# EAGLE schematic Motor_Board-Rev6 (EAGLE 6.6.0)
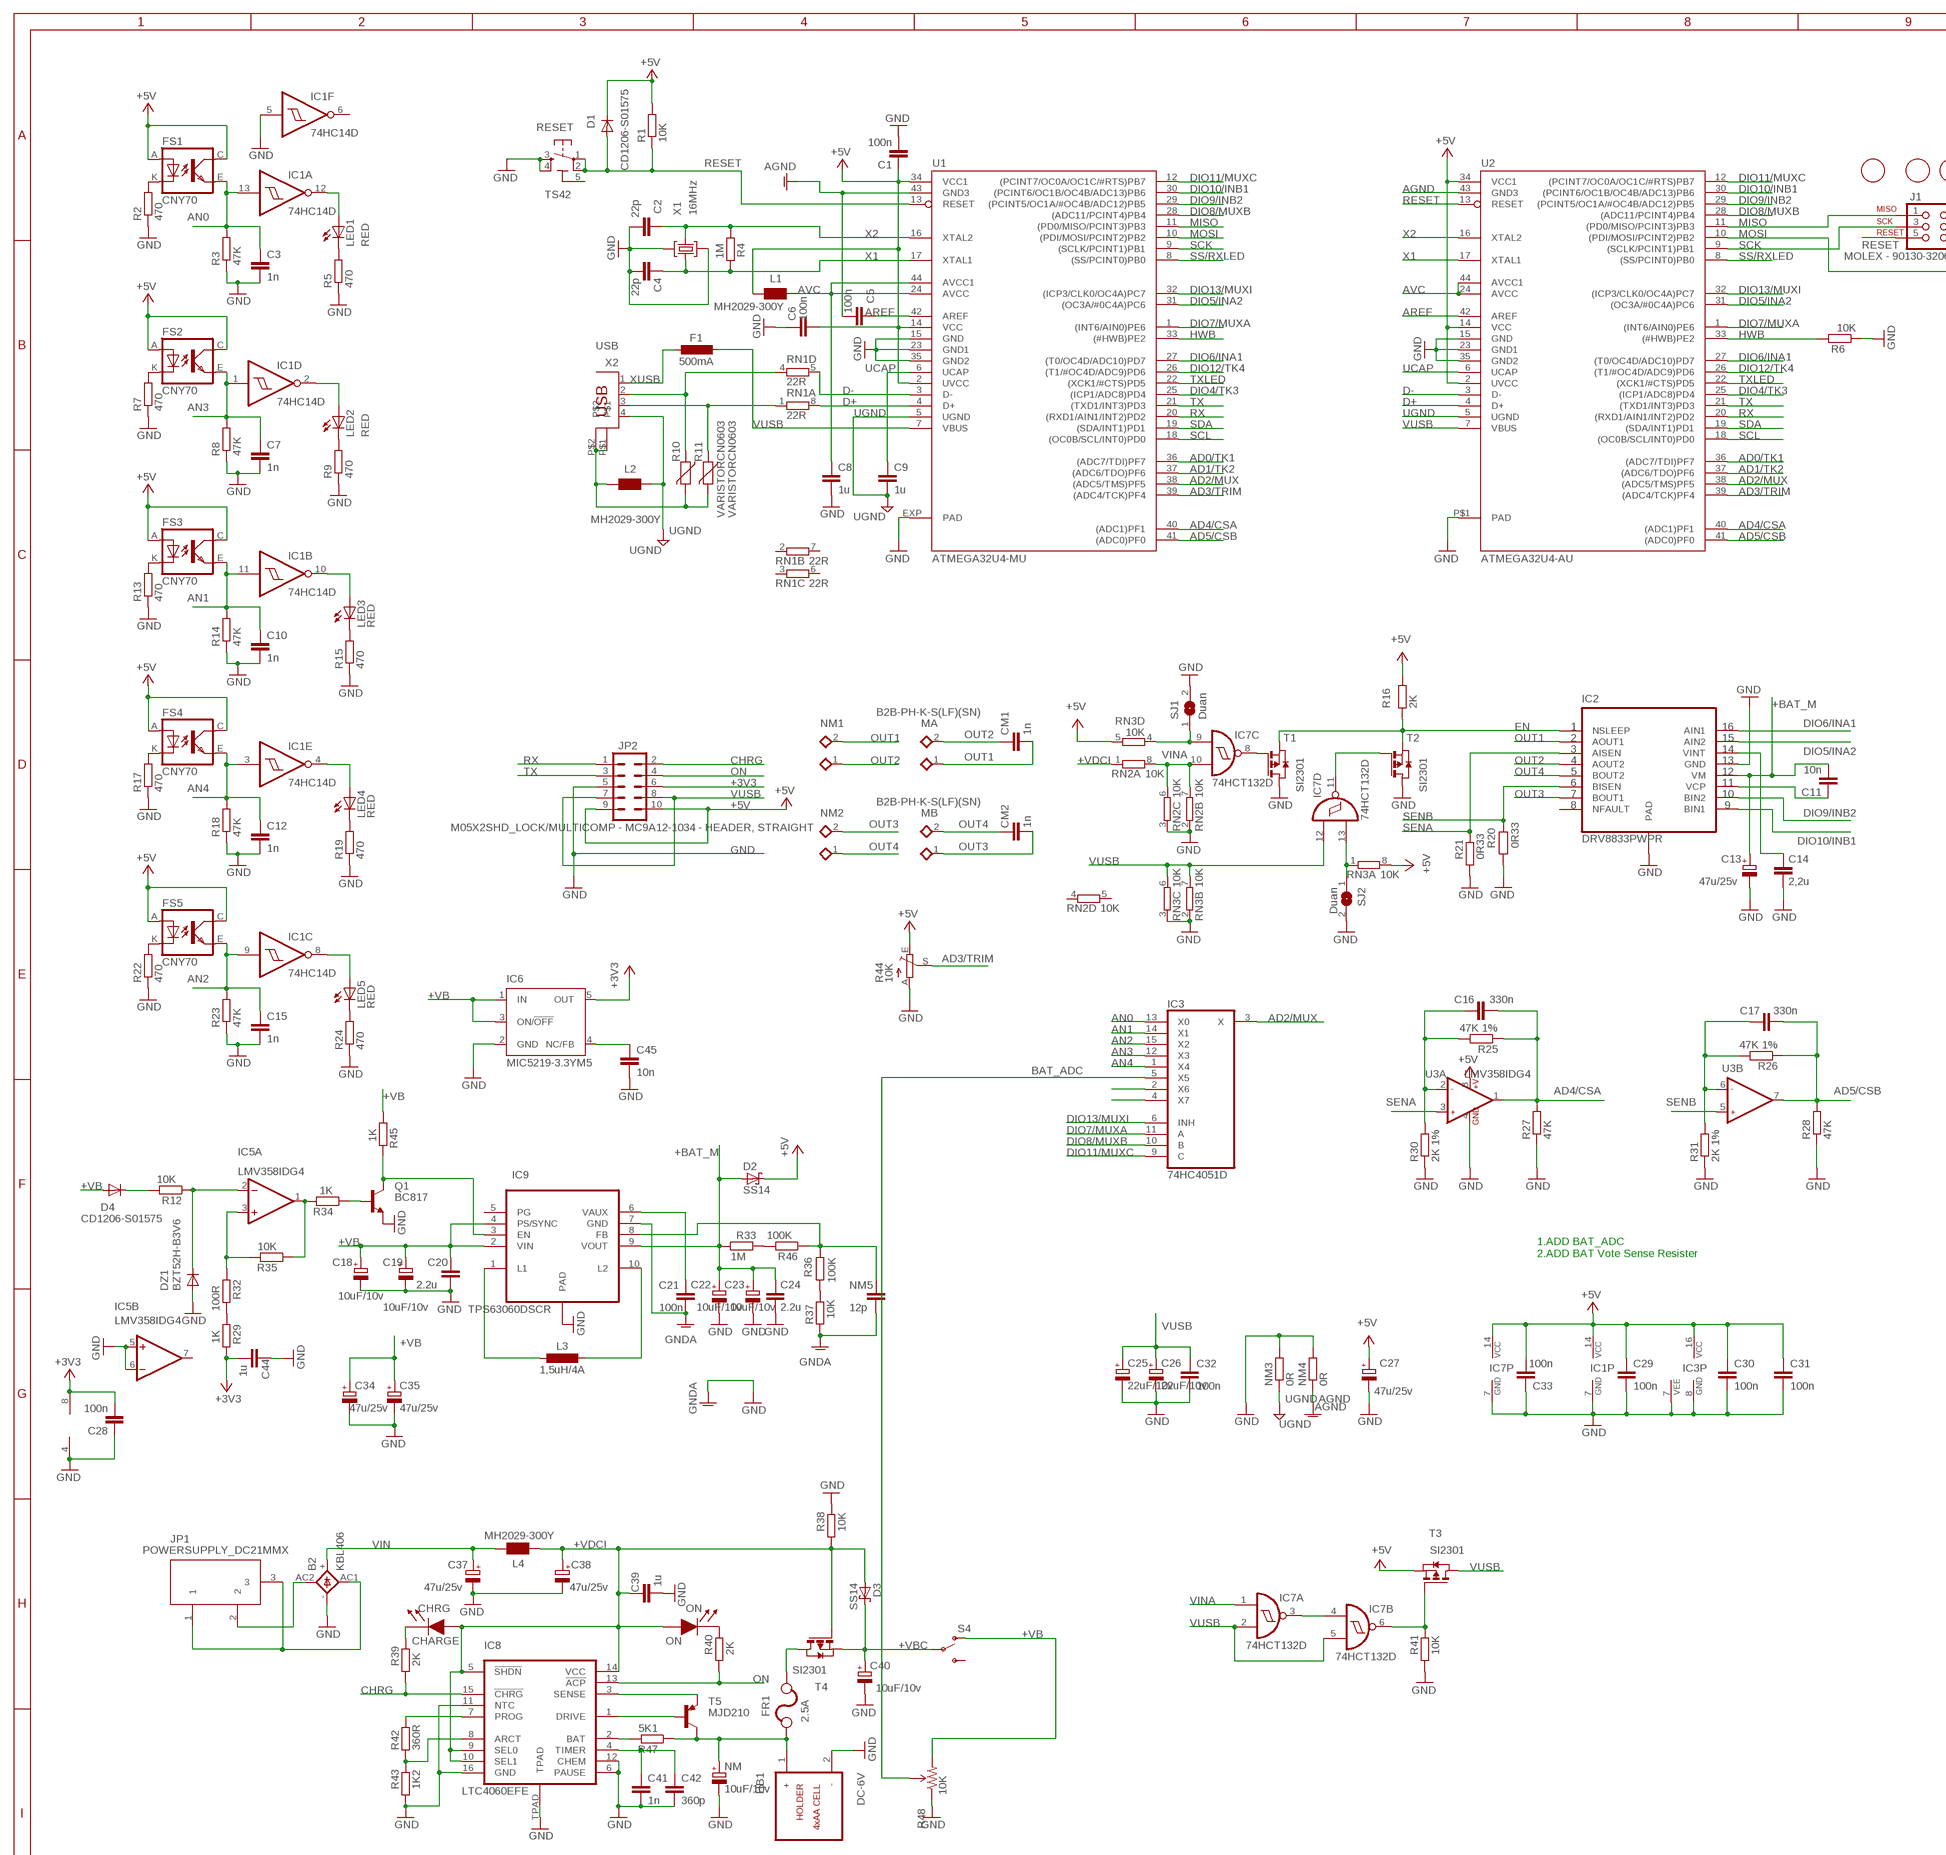
[diagram p0: schematic, sheet 1, part 1 of 2]
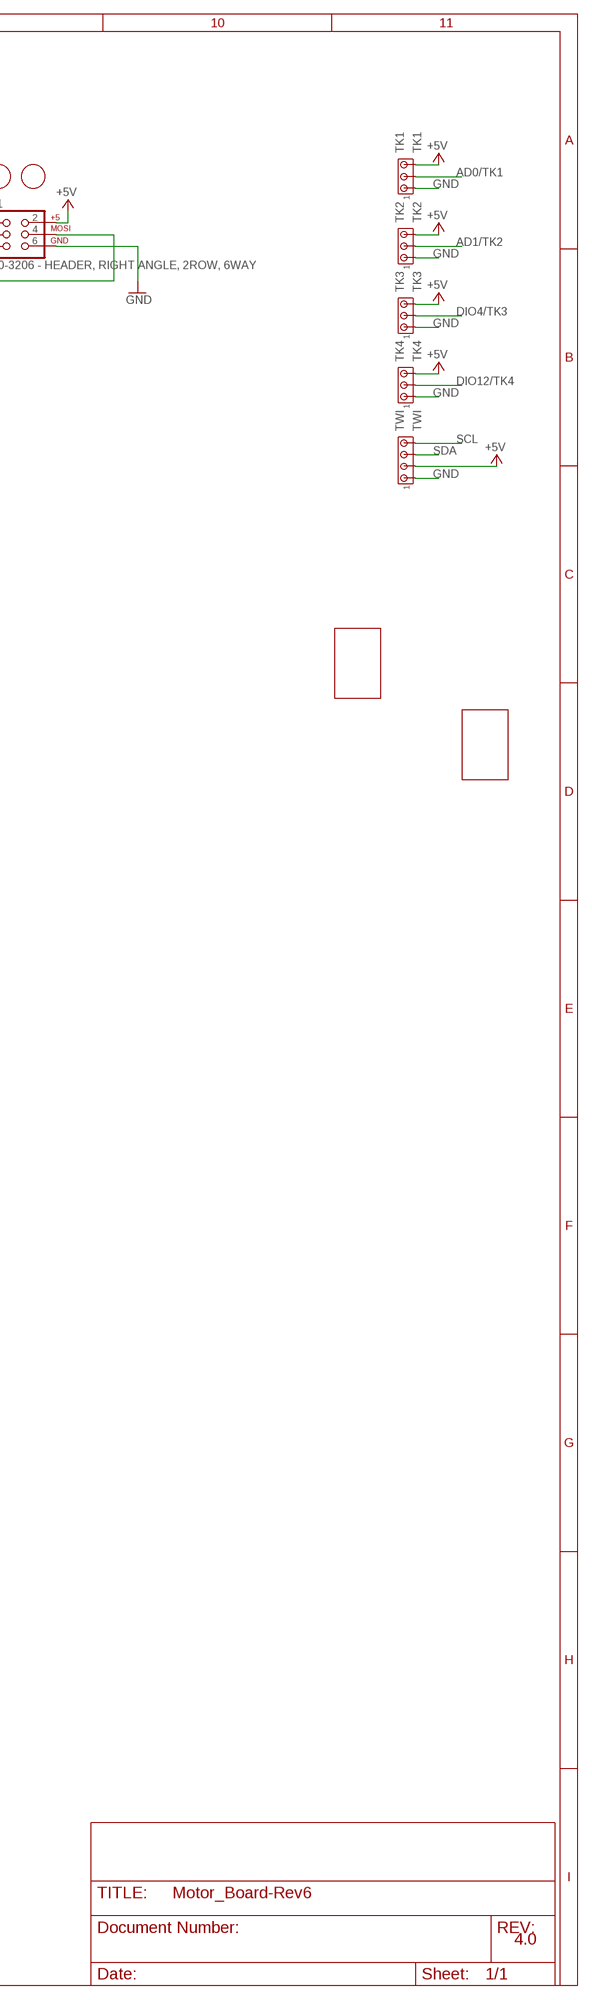
[diagram p1: schematic, sheet 1, part 2 of 2]

## Parts
B2  KBL406  KBL  [KBL]
C1  100n  C-EUC0603  [C0603-ROUND]
C2  22p  C-EUC0603  [C0603-ROUND]
C3  1n  C-EUC0603  [C0603-ROUND]
C4  22p  C-EUC0603  [C0603-ROUND]
C5  100n  C-EUC0603  [C0603-ROUND]
C6  100n  C-EUC0603  [C0603-ROUND]
C7  1n  C-EUC0603  [C0603-ROUND]
C8  1u  C-EUC0603  [C0603-ROUND]
C9  1u  C-EUC0603  [C0603-ROUND]
C10  1n  C-EUC0603  [C0603-ROUND]
C11  10n  C-EUC0603  [C0603-ROUND]
C12  1n  C-EUC0603  [C0603-ROUND]
C13  47u/25v  CPOL-EUD  [PANASONIC_D]
C14  2,2u  C-EUC0805K  [C0805K]
C15  1n  C-EUC0603  [C0603-ROUND]
C16  330n  C-EUC0603  [C0603-ROUND]
C17  330n  C-EUC0603  [C0603-ROUND]
C18  10uF/10v  CPOL-EUSMCB  [SMC_B]
C19  10uF/10v  CPOL-EUSMCB  [SMC_B]
C20  2.2u  C-EUC0805K  [C0805K]
C21  100n  C-EUC0603  [C0603-ROUND]
C22  10uF/10v  CPOL-EUSMCB  [SMC_B]
C23  10uF/10v  CPOL-EUSMCB  [SMC_B]
C24  2.2u  C-EUC0805K  [C0805K]
C25  22uF/10v  CPOL-EUSMCB  [SMC_B]
C26  22uF/10v  CPOL-EUSMCB  [SMC_B]
C27  47u/25v  CPOL-EUD  [PANASONIC_D]
C28  100n  C-EUC0603  [C0603-ROUND]
C29  100n  C-EUC0603  [C0603-ROUND]
C30  100n  C-EUC0603  [C0603-ROUND]
C31  100n  C-EUC0603  [C0603-ROUND]
C32  100n  C-EUC0603  [C0603-ROUND]
C33  100n  C-EUC0603  [C0603-ROUND]
C34  47u/25v  CPOL-EUD  [PANASONIC_D]
C35  47u/25v  CPOL-EUD  [PANASONIC_D]
C37  47u/25v  CPOL-EUD  [PANASONIC_D]
C38  47u/25v  CPOL-EUD  [PANASONIC_D]
C39  1u  C-EUC0603  [C0603-ROUND]
C40  10uF/10v  CPOL-EUSMCB  [SMC_B]
C41  1n  C-EUC0603  [C0603-ROUND]
C42  360p  C-EUC0603  [C0603-ROUND]
C44  1u  C-EUC0603  [C0603-ROUND]
C45  10n  C-EU0603-RND  [C0603-ROUND]
CHRG  CHARGE  MYSMD_LED0805  [SMD_LED0805]
CM1  1n  C-EUC0603  [C0603-ROUND]
CM2  1n  C-EUC0603  [C0603-ROUND]
D1  CD1206-S01575  DIODE-MINIMELF  [MINIMELF]
D2  SS14  SCHOTTKY-DIODESMD  [SMB]
D3  SS14  SCHOTTKY-DIODESMD  [SMB]
D4  CD1206-S01575  DIODE-MINIMELF  [MINIMELF]
DCML1  COMPLUBOT1_LOTTIE_LEMON_DC_MOTOR_48X_L  [COMPLUBOT1_CARCASA_MOTOR_L_LOTTIE_LEMON]
DZ1  BZT52H-B3V6  DIODE-SOD123  [SOD123]
F1  500mA  L-EUL1812  [L1812]
FM1  FIDUCIALMOUNT  [FIDUCIA-MOUNT]
FM2  FIDUCIALMOUNT  [FIDUCIA-MOUNT]
FM3  FIDUCIALMOUNT  [FIDUCIA-MOUNT]
FR1  2.5A  PTC_RESETTABLE_FUSES  [MF-MSMF-S2]
FS1  CNY70  [4]
FS2  CNY70  [4]
FS3  CNY70  [4]
FS4  CNY70  [4]
FS5  CNY70  [4]
HB1  DC-6V  SMARTPRJ_4XAA-BATTERY_HOLDER  [SMARTPRJ_4XAA_BATTERY-HOLDER]
IC1  74HC14D  [SO14]
IC2  DRV8833PWPR  DRV8833  [R-PDSO-G16]
IC3  74HC4051D  4051D  [SO16]
IC5  LMV358IDG4  LM358D  [SO08]
IC6  MIC5219-3.3YM5  LP2985-XXDBVR33  [SOT23-DBV]
IC7  74HCT132D  [SO14]
IC8  LTC4060EFE  LTC4060  [TSSOP16]
IC9  TPS63060DSCR  TPS63060  [R-PVSON-10N]
J1  MOLEX - 90130-3206 - HEADER, RIGHT ANGLE, 2ROW, 6WAY  AVR_SPI_PRG_6PTH  [2X3]
JP1  POWERSUPPLY_DC21MMX  [POWERSUPPLY_DC-21MM]
JP2  M05X2SHD_LOCK/MULTICOMP - MC9A12-1034 - HEADER, STRAIGHT  M05X2SHD_LOCK  [2X5-SHROUDED_LOCK]
L1  MH2029-300Y  WE-CBF_0805  [0805]
L2  MH2029-300Y  WE-CBF_0805  [0805]
L3  1,5uH/4A  L-EUWE-TPC  [POWER-CHOKE_WE-TPC]
L4  MH2029-300Y  WE-CBF_0805  [0805]
LED1  RED  LEDCHIP-LED0805  [CHIP-LED0805]
LED2  RED  LEDCHIP-LED0805  [CHIP-LED0805]
LED3  RED  LEDCHIP-LED0805  [CHIP-LED0805]
LED4  RED  LEDCHIP-LED0805  [CHIP-LED0805]
LED5  RED  LEDCHIP-LED0805  [CHIP-LED0805]
MA  B2B-PH-K-S(LF)(SN)  B2B-PH-KL  [B2B-PH_KL]
MB  B2B-PH-K-S(LF)(SN)  B2B-PH-KL  [B2B-PH_KL]
NM  10uF/10v  CPOL-EUSMCB  [SMC_B]
NM1  B2B-PH-K-S(LF)(SN)  B2B-PH-KL  [B2B-PH_KL]
NM2  B2B-PH-K-S(LF)(SN)  B2B-PH-KL  [B2B-PH_KL]
NM3  0R  R-EU_R0805  [R0805]
NM4  0R  R-EU_R0805  [R0805]
NM5  12p  C-EUC0603  [C0603-ROUND]
ON  ON  MYSMD_LED0805  [SMD_LED0805]
Q1  BC817  BC847BSMD  [SOT23]
R1  10K  R-EU_0603-RND  [R0603-ROUND]
R2  470  R-EU_R0603  [R0603-ROUND]
R3  47K  R-EU_R0603  [R0603-ROUND]
R4  1M  R-EU_0603-RND  [R0603-ROUND]
R5  470  R-EU_R0603  [R0603-ROUND]
R6  10K  R-EU_0603-RND  [R0603-ROUND]
R7  470  R-EU_R0603  [R0603-ROUND]
R8  47K  R-EU_0603-RND  [R0603-ROUND]
R9  470  R-EU_0603-RND  [R0603-ROUND]
R10  VARISTORCN0603  [CT/CN0603]
R11  VARISTORCN0603  [CT/CN0603]
R12  10K  R-EU_0603-RND  [R0603-ROUND]
R13  470  R-EU_R0603  [R0603-ROUND]
R14  47K  R-EU_R0603  [R0603-ROUND]
R15  470  R-EU_R0603  [R0603-ROUND]
R16  2K  R-EU_0603-RND  [R0603-ROUND]
R17  470  R-EU_R0603  [R0603-ROUND]
R18  47K  R-EU_R0603  [R0603-ROUND]
R19  470  R-EU_R0603  [R0603-ROUND]
R20  0R33  R-EU_R1206  [R1206]
R21  0R33  R-EU_R1206  [R1206]
R22  470  R-EU_R0603  [R0603-ROUND]
R23  47K  R-EU_R0603  [R0603-ROUND]
R24  470  R-EU_R0603  [R0603-ROUND]
R25  47K 1%  R-EU_0603-RND  [R0603-ROUND]
R26  47K 1%  R-EU_0603-RND  [R0603-ROUND]
R27  47K  R-EU_0603-RND  [R0603-ROUND]
R28  47K  R-EU_0603-RND  [R0603-ROUND]
R29  1K  R-EU_0603-RND  [R0603-ROUND]
R30  2K 1%  R-EU_0603-RND  [R0603-ROUND]
R31  2K 1%  R-EU_0603-RND  [R0603-ROUND]
R32  100R  R-EU_0603-RND  [R0603-ROUND]
R33  1M  R-EU_0603-RND  [R0603-ROUND]
R34  1K  R-EU_0603-RND  [R0603-ROUND]
R35  10K  R-EU_0603-RND  [R0603-ROUND]
R36  100K  R-EU_0603-RND  [R0603-ROUND]
R37  10K  R-EU_0603-RND  [R0603-ROUND]
R38  10K  R-EU_0603-RND  [R0603-ROUND]
R39  2K  R-EU_0603-RND  [R0603-ROUND]
R40  2K  R-EU_0603-RND  [R0603-ROUND]
R41  10K  R-EU_0603-RND  [R0603-ROUND]
R42  360R  R-EU_0603-RND  [R0603-ROUND]
R43  1K2  R-EU_0603-RND  [R0603-ROUND]
R44  10K  TRIM_EU-B25P  [B25P]
R45  1K  R-EU_0603-RND  [R0603-ROUND]
R46  100K  R-EU_0603-RND  [R0603-ROUND]
R47  5K1  R-EU_0603-RND  [R0603-ROUND]
R48  10K  TRIMPOT-2  [TRIMPOT_TC33]
RESET  TS42  [TS42]
RN1  22R  4R-NCAY16  [CAY16]
RN2  10K  4R-NCAY16  [CAY16]
RN3  10K  4R-NCAY16  [CAY16]
S4  SWITCH-SPDTML  [SWITCH-SPDT]
SJ1  Duan  SJL  [SJL]
SJ2  Duan  SJL  [SJL]
T1  SI2301  PMOSSOT23  [SOT-23]
T2  SI2301  PMOSSOT23  [SOT-23]
T3  SI2301  PMOSSOT23  [SOT-23]
T4  SI2301  PMOSSOT23  [SOT-23]
T5  MJD210  MJD32  [DPAK]
TK1  TK1  MTA03-100  [10X03MTA]
TK2  TK2  MTA03-100  [10X03MTA]
TK3  TK3  MTA03-100  [10X03MTA]
TK4  TK4  MTA03-100  [10X03MTA]
TWI  TWI  MTA04-100  [10X04MTA]
U1  ATMEGA32U4-MU  ATMEGA32U4-XUMU  [QFN44ML7X7]
U2  ATMEGA32U4-AU  ATMEGA32U4-XUAU  [TQFP44-PAD]
U3  LMV358IDG4  IC_LMV358-SO08  [IC_SO08]
U$1  COMPLUBOT1_LOTTIE_LEMON_DC_MOTOR_48X_R  [COMPLUBOT1_CARCASA_MOTOR_R_LOTTIE_LEMON]
U$2  LOTTIE_LEMON_PADS  [PADS_LOTTIE_LEMON]
U$3  COMPLUBOT_LOTTIE_LEMON_BASE_TYPE001  [COMPLUBOT_BASE_ROBOT_001]
W3  COMPLUBOT_LOTTIE_LEMON_WHEEL2  [COMPLUBOT_WHEEL-70X15]
W4  COMPLUBOT_LOTTIE_LEMON_WHEEL2  [COMPLUBOT_WHEEL-70X15]
X1  16MHz  CRYSTAL-3.2-2.5  [CRYSTAL-3.2-2.5]
X2  USB  PN61729  [PN61729]

## Nets
+3V3: C28.2 C44.1 IC5.8(P:V+) IC6.5(OUT) JP2.6 R29.2
+5V [+5v]: C1.1 C6.2 C27.+ C29.1 C30.1 C31.1 C33.2 D1.C D2.C FS1.A FS1.C(COL) FS2.A FS2.C(COL) FS3.A FS3.C(COL) FS4.A FS4.C(COL) FS5.A FS5.C(COL) IC1.14(P:VCC) IC3.16(VCC) IC7.14(P:VCC) J1.2 JP2.9 JP2.10 L1.1 R1.2 R16.2 R44.E RN3.5 RN3.8 T3.2(S) TK1.3 TK2.3 TK3.3 TK4.3 TWI.2 U1.2(UVCC) U1.14(VCC) U1.34(VCC1) U2.2(UVCC) U2.14(VCC) U2.34(VCC1) U3.8(A:+V)
+BAT_M [power]: C11.2 C13.+ C22.+ C23.+ C24.1 D2.A IC2.P$12(VM) IC9.9(VOUT) R33.1
+VB [power]: C18.+ C19.+ C20.1 C34.+ C35.+ D4.A IC6.1(IN) IC6.3(ON/!OFF) IC9.2(VIN) IC9.4(PS/SYNC) R45.1 R48.3(CW) S4.3(O)
+VBC [+5v]: C40.+ D3.C S4.2(P) T4.2(S)
+VDCI [power]: C38.+ C39.2 CHRG.2(AN) D3.A IC8.5(!SHDN) IC8.9(SEL0) IC8.10(SEL1) IC8.14(VCC) L4.2 ON.2(AN) R38.1 RN2.1 T4.3(G)
AD0/TK1: TK1.2 U1.36((ADC7/TDI)PF7) U2.36((ADC7/TDI)PF7)
AD1/TK2: TK2.2 U1.37((ADC6/TDO)PF6) U2.37((ADC6/TDO)PF6)
AD2/MUX: IC3.3(X) U1.38((ADC5/TMS)PF5) U2.38((ADC5/TMS)PF5)
AD3/TRIM: R44.S U1.39((ADC4/TCK)PF4) U2.39((ADC4/TCK)PF4)
AD4/CSA: C16.2 R25.1 R27.2 U1.40((ADC1)PF1) U2.40((ADC1)PF1) U3.1(A:OUT1)
AD5/CSB: C17.2 R26.1 R28.2 U1.41((ADC0)PF0) U2.41((ADC0)PF0) U3.7(B:OUT2)
AGND: C5.2 NM4.1 U1.43(GND3) U2.43(GND3)
AN0: C3.1 FS1.E(EMI) IC1.13(A:I) IC3.13(X0) R3.2
AN1: C10.1 FS3.E(EMI) IC1.11(B:I) IC3.14(X1) R14.2
AN2: C15.1 FS5.E(EMI) IC1.9(C:I) IC3.15(X2) R23.2
AN3: C7.1 FS2.E(EMI) IC1.1(D:I) IC3.12(X3) R8.2
AN4: C12.1 FS4.E(EMI) IC1.3(E:I) IC3.1(X4) R18.2
AREF: C5.1 U1.42(AREF) U2.42(AREF)
AVC: C8.1 L1.2 U1.24(AVCC) U1.44(AVCC1) U2.24(AVCC) U2.44(AVCC1)
BAT_ADC: IC3.5(X5) R48.2(WIPER)
CHRG: IC8.15(!CHRG) JP2.2 R39.1
D+: RN1.8 U1.4(D+) U2.4(D+)
D-: RN1.5 U1.3(D-) U2.3(D-)
DIO4/TK3: TK3.2 U1.25((ICP1/ADC8)PD4) U2.25((ICP1/ADC8)PD4)
DIO5/INA2: IC2.P$15(AIN2) U1.31((OC3A/#0C4A)PC6) U2.31((OC3A/#0C4A)PC6)
DIO6/INA1: IC2.P$16(AIN1) U1.27((T0/OC4D/ADC10)PD7) U2.27((T0/OC4D/ADC10)PD7)
DIO7/MUXA: IC3.11(A) U1.1((INT6/AIN0)PE6) U2.1((INT6/AIN0)PE6)
DIO8/MUXB: IC3.10(B) U1.28((ADC11/PCINT4)PB4) U2.28((ADC11/PCINT4)PB4)
DIO9/INB2: IC2.P$10(BIN2) U1.29((PCINT5/OC1A/#OC4B/ADC12)PB5) U2.29((PCINT5/OC1A/#OC4B/ADC12)PB5)
DIO10/INB1: IC2.P$9(BIN1) U1.30((PCINT6/OC1B/OC4B/ADC13)PB6) U2.30((PCINT6/OC1B/OC4B/ADC13)PB6)
DIO11/MUXC: IC3.9(C) U1.12((PCINT7/OC0A/OC1C/#RTS)PB7) U2.12((PCINT7/OC0A/OC1C/#RTS)PB7)
DIO12/TK4: TK4.2 U1.26((T1/#OC4D/ADC9)PD6) U2.26((T1/#OC4D/ADC9)PD6)
DIO13/MUXI: IC3.6(INH) U1.32((ICP3/CLK0/OC4A)PC7) U2.32((ICP3/CLK0/OC4A)PC7)
EN [+5v]: IC2.P$1(NSLEEP) R16.1 T1.2(S) T2.2(S)
GND [gnd]: B2.- C1.2 C2.2 C3.2 C4.2 C6.1 C7.2 C8.2 C10.2 C12.2 C13.- C14.2 C15.2 C18.- C19.- C20.2 C22.- C23.- C24.2 C25.- C26.- C27.- C28.1 C29.2 C30.2 C31.2 C32.1 C33.1 C34.- C35.- C37.- C38.- C39.1 C40.- C41.2 C42.2 C44.2 C45.2 DZ1.A HB1.2(-) IC1.5(F:I) IC1.7(P:GND) IC2.P$13(GND) IC2.P$17(PAD) IC3.7(VEE) IC3.8(GND) IC5.4(P:V-) IC5.5(B:+IN) IC5.6(B:-IN) IC6.2(GND) IC7.7(P:GND) IC8.6(PAUSE) IC8.11(NTC) IC8.12(CHEM) IC8.16(GND) IC8.TPAD IC9.PAD J1.6 JP2.5 NM3.2 NM4.2 NM.- Q1.2(E) R2.1 R3.1 R5.1 R6.1 R7.1 R8.1 R9.1 R13.1 R14.1 R15.1 R17.1 R18.1 R19.1 R20.1 R21.1 R22.1 R23.1 R24.1 R27.1 R28.1 R30.1 R31.1 R38.2 R41.1 R43.1 R44.A R48.1(CCW) RESET.3 RESET.4 RN2.2 RN2.3 RN3.2 RN3.3 SJ1.2 SJ2.2 T1.1(D) T2.1(D) TK1.1 TK2.1 TK3.1 TK4.1 TWI.1 U1.15(GND) U1.23(GND1) U1.35(GND2) U1.EXP(PAD) U2.15(GND) U2.23(GND1) U2.35(GND2) U2.P$1(PAD) U3.4(A:GND) X1.2(GND) X1.4(GND)
GNDA [gnd]: C21.2 IC9.7(GND) NM5.2 R37.1 ; supply symbol labelled GND
HWB: R6.2 U1.33((#HWB)PE2) U2.33((#HWB)PE2)
MISO: J1.1 U1.11((PD0/MISO/PCINT3)PB3) U2.11((PD0/MISO/PCINT3)PB3)
MOSI: J1.4 U1.10((PDI/MOSI/PCINT2)PB2) U2.10((PDI/MOSI/PCINT2)PB2)
N$1: CHRG.1(CA) R39.2
N$3: IC7.3(A:O) IC7.4(B:I0)
N$4 [power]: B2.AC2(AC1) JP1.2
N$5: IC1.12(A:O) LED1.A
N$6: IC1.10(B:O) LED3.A
N$7 [power]: B2.AC1(AC2) JP1.1 JP1.3
N$8: IC3.2(X6)
N$9: L2.1 R10.2 R11.2 X2.P$1 X2.P$2
N$10: IC3.4(X7)
N$11: IC7.13(D:I1) RN3.1 SJ2.1
N$12: IC9.10(L2) L3.2
N$13: IC8.8(ARCT) R42.1 R43.2
N$14: FS1.K(C) R2.2
N$15: FS3.K(C) R13.2
N$16: LED1.C R5.2
N$17: IC8.7(PROG) R42.2
N$18: LED3.C R15.2
N$19: FS5.K(C) R22.2
N$20: FS2.K(C) R7.2
N$21: IC7.6(B:O) R41.2 T3.3(G)
N$22: LED5.C R24.2
N$23: C11.1 IC2.P$11(VCP)
N$24: FS4.K(C) R17.2
N$25: LED4.C R19.2
N$26: LED2.C R9.2
N$27: IC8.3(SENSE) T5.3(E)
N$28: C17.1 R26.2 R31.2 U3.6(B:-IN2)
N$29: C16.1 R25.2 R30.2 U3.2(A:-IN1)
N$30: IC7.8(C:O) T1.3(G)
N$31: IC8.1(DRIVE) T5.1(B)
N$32: ON.1(CA) R40.2
N$33: FR1.P$1 HB1.1(+) NM.+ R47.1 T5.4(C)
N$34: C41.1 C42.1 IC8.4(TIMER)
N$35: C21.1 IC9.6(VAUX)
N$36: IC1.8(C:O) LED5.A
N$37: IC1.2(D:O) LED2.A
N$38: IC1.4(E:O) LED4.A
N$39: IC9.8(FB) NM5.1 R36.1 R46.1
N$40: IC7.11(D:O) T2.3(G)
N$41: C45.1 IC6.4(NC/FB)
N$42: C14.1 IC2.P$14(VINT)
N$43: R36.2 R37.2
N$44: IC7.9(C:I0) RN3.4 SJ1.1
N$45: IC5.3(A:+IN) R32.1 R35.2
N$46: FR1.P$2 T4.1(D)
N$47: IC9.1(L1) L3.1
N$48: DZ1.C IC5.2(A:-IN) R12.1
N$49: R29.1 R32.2
N$50: IC9.3(EN) Q1.3(C) R45.2
N$51: R11.1 RN1.1 X2.3
N$52: IC5.1(A:OUT) R34.2 R35.1
N$53: Q1.1(B) R34.1
N$54: R10.1 RN1.4 X2.2
N$55: D4.C R12.2
N$56: R33.2 R46.2
N$57: IC8.2(BAT) R47.2
ON: IC8.13(!ACP) JP2.4 R40.1
OUT1: CM1.2 IC2.P$2(AOUT1) MA.1 NM1.2
OUT2: CM1.1 IC2.P$4(AOUT2) MA.2 NM1.1
OUT3: CM2.1 IC2.P$7(BOUT1) MB.1 NM2.2
OUT4: CM2.2 IC2.P$5(BOUT2) MB.2 NM2.1
RESET: D1.A J1.5 R1.1 RESET.1 RESET.2 U1.13(RESET) U2.13(RESET)
RX: JP2.1 U1.20((RXD1/AIN1/INT2)PD2) U2.20((RXD1/AIN1/INT2)PD2)
SCK: J1.3 U1.9((SCLK/PCINT1)PB1) U2.9((SCLK/PCINT1)PB1)
SCL: TWI.4 U1.18((OC0B/SCL/INT0)PD0) U2.18((OC0B/SCL/INT0)PD0)
SDA: TWI.3 U1.19((SDA/INT1)PD1) U2.19((SDA/INT1)PD1)
SENA: IC2.P$3(AISEN) R21.2 U3.3(A:+IN1)
SENB: IC2.P$6(BISEN) R20.2 U3.5(B:+IN2)
SS/RXLED: U1.8((SS/PCINT0)PB0) U2.8((SS/PCINT0)PB0)
TX: JP2.3 U1.21((TXD1/INT3)PD3) U2.21((TXD1/INT3)PD3)
TXLED: U1.22((XCK1/#CTS)PD5) U2.22((XCK1/#CTS)PD5)
UCAP: C9.1 U1.6(UCAP) U2.6(UCAP)
UGND: C9.2 L2.2 NM3.1 U1.5(UGND) U2.5(UGND) X2.4
VIN: B2.+ C37.+ L4.1
VINA: IC7.1(A:I0) IC7.10(C:I1) RN2.6 RN2.7 RN2.8
VUSB [usbvcc]: C25.+ C26.+ C32.2 F1.2 IC7.2(A:I1) IC7.5(B:I1) IC7.12(D:I0) JP2.7 JP2.8 RN3.6 RN3.7 T3.1(D) U1.7(VBUS) U2.7(VBUS)
X1: C4.1 R4.2 U1.17(XTAL1) U2.17(XTAL1) X1.1(C1)
X2: C2.1 R4.1 U1.16(XTAL2) U2.16(XTAL2) X1.3(C2)
XUSB: F1.1 X2.1
Unconnected: IC1.6(F:O) IC2.P$8(NFAULT) IC5.7(B:OUT) IC9.5(PG) RN1.2 RN1.3 RN1.6 RN1.7 RN2.4 RN2.5 S4.1(S)

## Notes on the sheet
- 1.ADD BAT_ADC 
  2.ADD BAT Vote Sense Resister
- 4.0

## Power pins joined to a net without a drawn wire
5-GND: RESET.5(5-GND)

## Library data of the parts
B2 = Smartprj:KBL: DIOTEC RECTIFIER
C1-C12 C14-C17 C20 C21 C24 C28-C33 C39 C41 C42 C44 C45 CM1 CM2 NM5 = Smartprj:C-EU: CAPACITOR, European symbol
C13 C18 C19 C22 C23 C25-C27 C34 C35 C37 C38 C40 NM = Smartprj:CPOL-EU: POLARIZED CAPACITOR, European symbol
CHRG ON = Smartprj:MYSMD_LED0805
D1 D4 DZ1 = diode:DIODE-: DIODE
D2 D3 = diode:SCHOTTKY-DIODE: Schottky Diode
DCML1 = BoardRev5.2.b:COMPLUBOT1_LOTTIE_LEMON_DC_MOTOR_48X_L: MOTOR DC GEAR 48X L This is the DC motor used at Lottie Lemon s first prototype series';
F1 = rcl:L-EU: INDUCTOR, European symbol
FM1-FM3 = Smartprj:FIDUCIALMOUNT
FR1 = Smartprj:PTC_RESETTABLE_FUSES
FS1-FS5 = cny70:CNY70
HB1 = BoardRev5.2.b:SMARTPRJ_4XAA-BATTERY_HOLDER: KEYSTONE 4xAA Battery Holder
IC1 = 74xx-eu:74*14: Hex schmitt trigger INVERTER
IC2 = Smartprj:DRV8833: DRV883 Dual H DC/STEPPER Motor Drive Ti
IC3 = 40xx:4051: 8-channel ANALOG MULTIPLEXER
IC5 = Smartprj:LM358: OP AMP also LM158; LM258; LM2904 Source: http://cache.national.com/ds/LM/LM158.pdf
IC6 = Smartprj:LP2985-XXDBVR: ULTRALOW-POWER 50-mA LOW-DROPOUT LINEAR REGULATORS 50-mA Low-Dropout Regulator Source: http://focus.ti.com/lit/ds/symlink/tps77001.pdf
IC7 = 74xx-eu:74*132: Quad 2-input NAND schmitt trigger
IC8 = Smartprj:LTC4060: LTC4060 Standalone Linear NiMH/NiCd 1 to 4 cells Fast Battery Charger LINEAR-TECHNOLOGY (LT)
IC9 = Smartprj:TPS63060: TPS63060 Single Inductor Buck-Boost Converter 2A Switches
J1 = SparkFun:AVR_SPI_PRG_6: AVR ISP 6 Pin This is the reduced ISP connector for AVR programming. Common on Arduino. This footprint will take up less PCB space and can be used with a 10-pin to 6-pin adapter such as SKU: BOB-08508
JP1 = Smartprj:POWERSUPPLY_DC21MM
JP2 = Smartprj:M05X2: Header 5x2 Standard 10-pin dual row 0.1" header. Commonly used with AVR-ISP. Use with Spark Fun Electronics SKU: PRT-00778
L1 L2 L4 = wuerth-elektronik:WE-CBF: SMD EMI Suppression Ferrite Beads - excellent anti-EMI properties - low DCR - impedances till 3000 ohms - rated current up to 6 A
L3 = Smartprj:L-EU: INDUCTOR, European symbol
LED1-LED5 = led:LED: LED OSRAM: - CHIPLED LG R971, LG N971, LY N971, LG Q971, LY Q971, LO R971, LY R971 LH N974, LH R974 LS Q976, LO Q976, LY Q976 LO Q996 - Hyper CHIPLED LW Q18S LB Q993, LB Q99A, LB R99A - SideLED LS A670, LO A670, LY A670, LG A670, LP A670 LB A673, LV A673, LT A673, LW A673 LH A674 LY A675 LS A676, LA A676, LO A676, LY A676, LW A676 LS A679, LY A679, LG A679 - Hyper Micro SIDELED® LS Y876, LA Y876, LO Y876, LY Y876 LT Y87S - SmartLED LW L88C, LW L88S LB L89C, LB L89S, LG L890 LS L89K, LO L89K, LY L89K LS L896, LA L896, LO L896, LY L896 - TOPLED LS T670, LO T670, LY T670, LG T670, LP T670 LSG T670, LSP T670, LSY T670, LOP T670, LYG T670 LG T671, LOG T671, LSG T671 LB T673, LV T673, LT T673, LW T673 LH T674 LS T676, LA T676, LO T676, LY T676, LB T676, LH T676, LSB T676, LW T676 LB T67C, LV T67C, LT T67C, LS T67K, LO T67K, LY T67K, LW E67C LS E67B, LA E67B, LO E67B, LY E67B, LB E67C, LV E67C, LT E67C LW T67C LS T679, LY T679, LG T679 LS T770, LO T770, LY T770, LG T770, LP T770 LB T773, LV T773, LT T773, LW T773 LH T774 LS E675, LA E675, LY E675, LS T675 LS T776, LA T776, LO T776, LY T776, LB T776 LHGB T686 LT T68C, LB T68C - Hyper Mini TOPLED® LB M676 - Mini TOPLED Santana® LG M470 LS M47K, LO M47K, LY M47K Source: http://www.osram.convergy.de LUXEON: - LUMILED® LXK2-PW12-R00, LXK2-PW12-S00, LXK2-PW14-U00, LXK2-PW14-V00 LXK2-PM12-R00, LXK2-PM12-S00, LXK2-PM14-U00 LXK2-PE12-Q00, LXK2-PE12-R00, LXK2-PE12-S00, LXK2-PE14-T00, LXK2-PE14-U00 LXK2-PB12-K00, LXK2-PB12-L00, LXK2-PB12-M00, LXK2-PB14-N00, LXK2-PB14-P00, LXK2-PB14-Q00 LXK2-PR12-L00, LXK2-PR12-M00, LXK2-PR14-Q00, LXK2-PR14-R00 LXK2-PD12-Q00, LXK2-PD12-R00, LXK2-PD12-S00 LXK2-PH12-R00, LXK2-PH12-S00 LXK2-PL12-P00, LXK2-PL12-Q00, LXK2-PL12-R00 Source: www.luxeon.com KINGBRIGHT: KA-3528ASYC Source: www.kingbright.com
MA MB NM1 NM2 = Smartprj:B2B-PH-KL: PH Connectors Two Wire Connector
NM3 NM4 = resistor:R-EU_: RESISTOR, European symbol
Q1 = transistor-npn:BC847*: NPN Transistor
R1-R9 R12-R43 R45-R47 = Smartprj:R-EU_: RESISTOR, European symbol
R10 R11 = varistor:VARISTOR: VARISTOR
R44 = pot:TRIM_EU-: POTENTIOMETER
R48 = SparkFun:TRIMPOT
RESET = Smartprj:TS42: TS42 Dongnan Electronics Tact switch VDC 12V - 50mA
RN1-RN3 = resistor-dil:4R-N: Array Chip Resistor Source: RS Component / Phycomp
S4 = TKJMixed:SWITCH-SPDT: SWITCH SLIDE MINI SPDT R/A Digikey: http://www.digikey.com/product-detail/en/L102021ML04Q/CKC5102-ND/181454 Datasheet: http://www.ck-components.com/14386/l_4jun13.pdf/; DIGIKEY: CKC5102-ND; NO: L102021ML04Q
SJ1 SJ2 = Smartprj:SJ: SMD solder JUMPER
T1-T4 = Smartprj:PMOSSOT23: MOS FET
T5 = transistor:MJD32*: Complementary Power Transistors
TK1-TK4 = con-amp:MTA03-100: AMP connector
TWI = con-amp:MTA04-100: AMP connector
U1 U2 = Smartprj:ATMEGA32U4-XU
U3 = mazebot:IC_LMV358: General purpose LOW Voltage, Rail-to-Rail Output Amplifiers http://www.fairchildsemi.com/ds/LM/LMV358.pdf
U$1 = BoardRev5.2.b:COMPLUBOT1_LOTTIE_LEMON_DC_MOTOR_48X_R: MOTOR DC GEAR 48X R This is the DC motor used at Lottie Lemon s first prototype series';
U$2 = complubot:LOTTIE_LEMON_PADS: PADS FOR LOTTIE LEMON Set of pads for the motor board of the Lottie Lemon Robot
U$3 = BoardRev5.2.b:COMPLUBOT_LOTTIE_LEMON_BASE_TYPE: Lottie Lemon Robot Base Lottie Lemon is two wheeled robot made of two PCBs. One contains the intelligence while the other carries the motors, their drivers, and line following sensors.
W3 W4 = BoardRev5.2.b:COMPLUBOT_LOTTIE_LEMON_WHEEL: WHEEL LOTTIE LEMON Wheels used for Lottie Lemon
X1 = Smartprj:CRYSTAL-3.2-2.5
X2 = Smartprj:PN61729: BERG USB connector

## Net classes
1 power: width 0.254 mm, drill 0.584 mm, clearance 0.203 mm
2 gnd: width 0.254 mm, drill 0.584 mm, clearance 0.203 mm
3 usbvcc: width 0.254 mm, drill 0.584 mm, clearance 0.203 mm
5 +5v: width 0.254 mm, drill 0.584 mm, clearance 0.203 mm